# EAGLE design current_sense_INA250 (EAGLE 8.2.2)
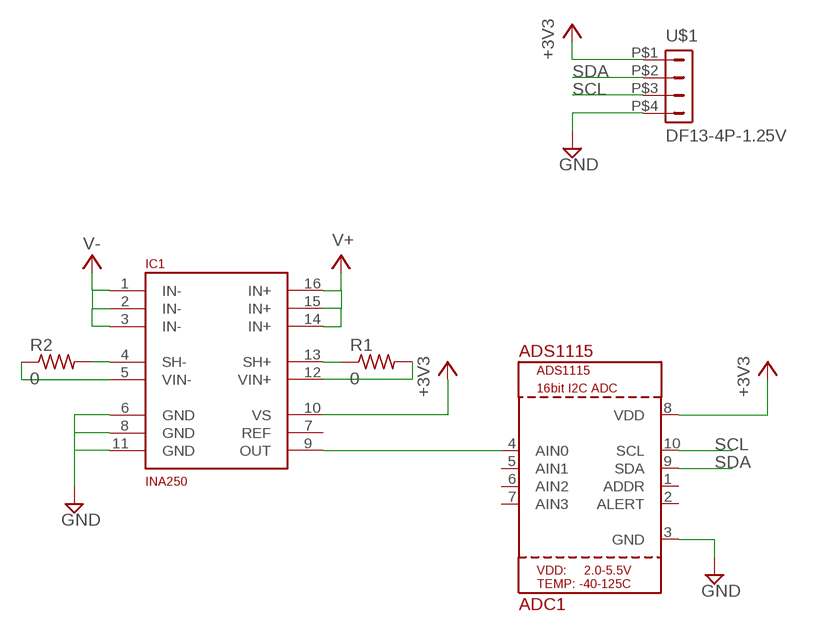
[diagram p0: schematic, sheet 1]

## Parts
ADC1  ADS1115  [MSOP10]
IC1  INA250  [TSSOP16]
R1  0  R-US_R0805  [R0805]
R2  0  R-US_R0805  [R0805]
U$1  DF13-4P-1.25V  [DF13C-4P-1.25V]

## Nets
+3V3: ADC1.8(VDD) IC1.10(VS) U$1.P$1
GND: ADC1.3(GND) IC1.6(GND) IC1.8(GND) IC1.11(GND) U$1.P$4
N$1: ADC1.4(AIN0) IC1.9(OUT)
N$4: IC1.4(SH-) R2.2
N$5: IC1.5(VIN-) R2.1
N$6: IC1.13(SH+) R1.1
N$7: IC1.12(VIN+) R1.2
SCL: ADC1.10(SCL) U$1.P$3
SDA: ADC1.9(SDA) U$1.P$2
V+: IC1.14(IN+) IC1.15(IN+) IC1.16(IN+)
V-: IC1.1(IN-) IC1.2(IN-) IC1.3(IN-)
Unconnected: ADC1.1(ADDR) ADC1.2(ALERT) ADC1.5(AIN1) ADC1.6(AIN2) ADC1.7(AIN3) IC1.7(REF)

## Library data of the parts
ADC1 = vtgs:ADS1115
IC1 = vtgs:INA250
R1 R2 = resistor:R-US_: RESISTOR, American symbol
U$1 = con-hirose-df13:DF13-4P-1.25: DF13-4P 1.25mm Pitch Miniature Crimping Connector.

## Board
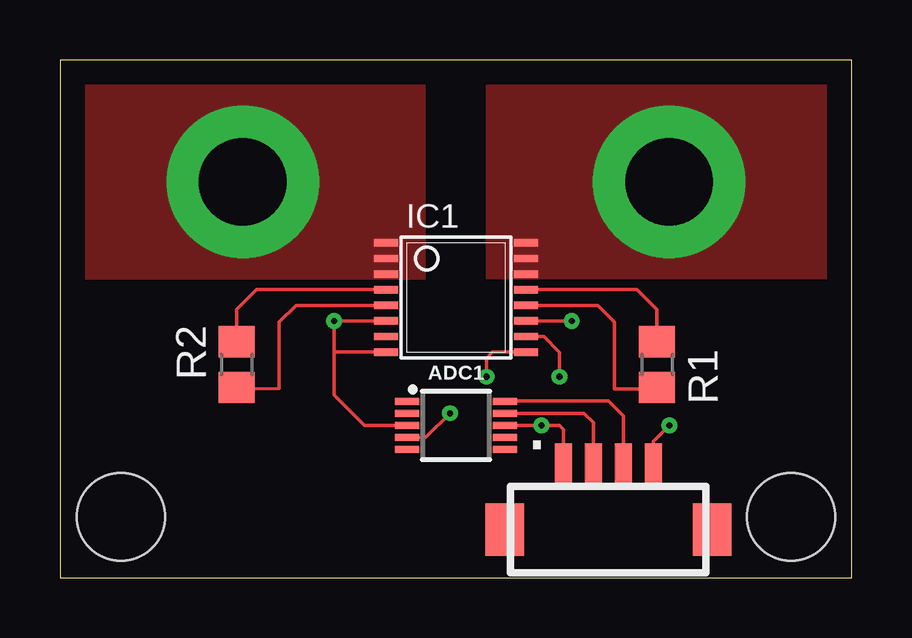
[diagram p1: board, top side]
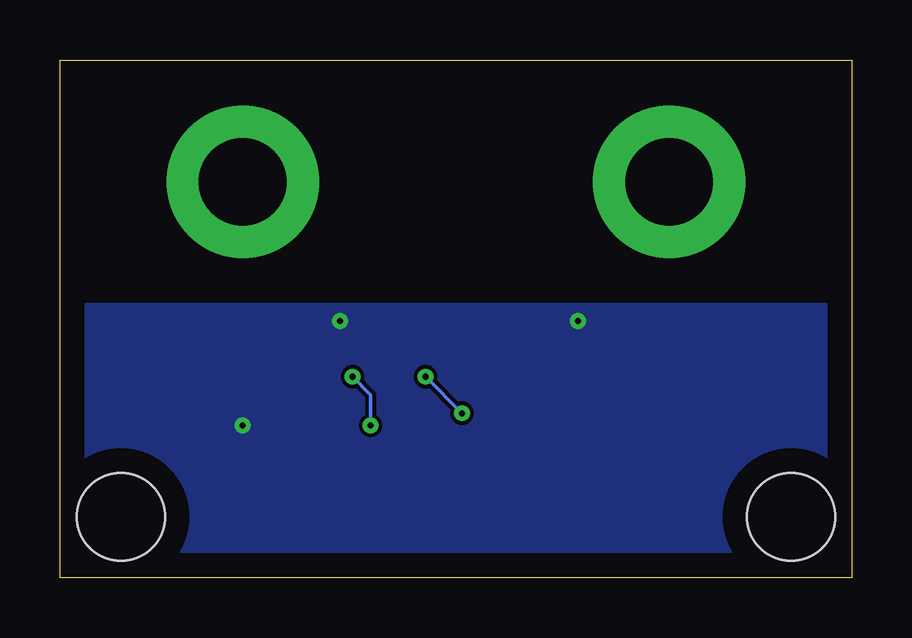
[diagram p2: board, bottom side, seen from below]

Size 33.02 x 21.59 mm. Coordinates in mm from the lower left corner, seen from the top.
Outline: 0,0 33.02,0 33.02,21.59 0,21.59 0,0
Copper layers (1*16): Top 0.035mm / dielectric 1.5mm / Bottom 0.035mm
Design rules "default": minimum track width 6mil, minimum drill 0.35mm, track to track 6mil, track to pad 6mil, pad to pad 6mil, via to via 6mil, smd to smd 6mil, copper to edge 40mil, drill to drill 6mil, minimum pad ring 10mil, minimum via ring 8mil, stop-mask expansion 4mil, vias tented up to drill 0mil, thermal gap 10mil
Holes 3.66 mm at 2.54,2.54 30.48,2.54

### Footprints (pad centres in the part's own frame; a part is rotated, then mirrored left to right if it is on the bottom)
MSOP10 = smd 0.3 x 1: 1 -1,-2.05; 2 -0.5,-2.05; 3 0,-2.05; 4 0.5,-2.05; 5 1,-2.05; 6 1,2.05; 7 0.5,2.05; 8 0,2.05; 9 -0.5,2.05; 10 -1,2.05
TSSOP16 = smd 0.305 x 0.991: 1 -2.275,-2.918; 2 -1.625,-2.918; 3 -0.975,-2.918; 4 -0.325,-2.918; 5 0.325,-2.918; 6 0.975,-2.918; 7 1.625,-2.918; 8 2.275,-2.918; 9 2.275,2.918; 10 1.625,2.918; 11 0.975,2.918; 12 0.325,2.918; 13 -0.325,2.918; 14 -0.975,2.918; 15 -1.625,2.918; 16 -2.275,2.918
R0805 = smd 1.3 x 1.5: 1 -0.95,0; 2 0.95,0
DF13C-4P-1.25V = smd 1.6 x 2.2: M$0 4.325,-1.8; M$1 -4.325,-1.8 | smd 0.7 x 1.8: P$1 -1.875,0.9; P$2 -0.625,0.9; P$3 0.625,0.9; P$4 1.875,0.9

### Placement (x,y rotation side)
ADC1  16.51,6.35 270 top
IC1  16.51,11.68 270 top
R1  24.89,8.89 270 top
R2  7.37,8.89 90 top
U$1  22.86,3.81 0 top

### Tracks (layer width: path | path; a pad name or v marks a point on that pad's centre or on a via)
+3V3  (via drill 0.25)
  Top 0.152: U$1.P$1 20.98,6.19 20.83,6.35 v20.07,6.35 ADC1.8 | IC1.10 20.17,10.06 20.83,9.4 v20.83,8.38
  Bottom 0.152: v20.83,8.38 20.07,7.62 v20.07,6.35
GND  (via drill 0.25)
  Top 0.152: IC1.6 v11.43,10.71 11.42,9.41 | IC1.8 11.42,9.41 | IC1.11 v21.34,10.71 | U$1.P$4 24.73,5.68 v25.4,6.35 | ADC1.3 12.7,6.35 11.45,7.6 | 11.45,7.6 11.43,7.62 | 11.42,9.41 11.42,7.63 11.45,7.6
  pour Bottom: 0,0 0,11.43 33.02,11.43 33.02,0
N$1  (via drill 0.25)
  Top 0.152: ADC1.4 15.25,5.85 v16.26,6.86 | IC1.9 18.02,9.41 17.78,9.14 v17.78,8.38
  Bottom 0.152: v16.26,6.86 v17.78,8.38
N$4
  Top 0.152: IC1.4 8.2,12.01 7.37,11.18 R2.2
N$5
  Top 0.152: R2.1 7.37,7.87 7.61,7.87 9.14,7.89 9.14,10.67 9.84,11.36 IC1.5
N$6
  Top 0.152: IC1.13 24.06,12.01 24.89,11.18 R1.1
N$7
  Top 0.152: R1.2 24.64,7.87 23.11,7.87 23.11,10.67 22.42,11.36 IC1.12
SCL
  Top 0.152: U$1.P$3 23.48,6.74 22.86,7.37 18.58,7.37 ADC1.10
SDA
  Top 0.152: U$1.P$2 22.23,6.47 21.84,6.86 ADC1.9
V+  (via drill 3.66 pad 6.35)
  other vias: 25.4,16.51
  pour Top (no thermals): 17.78,12.45 17.78,21.59 33.02,21.59 33.02,12.45
V-  (via drill 3.66 pad 6.35)
  other vias: 7.62,16.51
  pour Top (no thermals): 0,21.59 0,12.45 15.24,12.45 15.24,21.59